# Altium schematic sheet LED_CONTROL.SchDoc: RGB_LED_STRIP_CONTROL_BOARD
size A4; Author: Luca Schenetti; DrawnBy: Luca Schenetti; Engineer: Luca Schenetti; Revision: V1.0; SheetNumber: 2; SheetTotal: 2
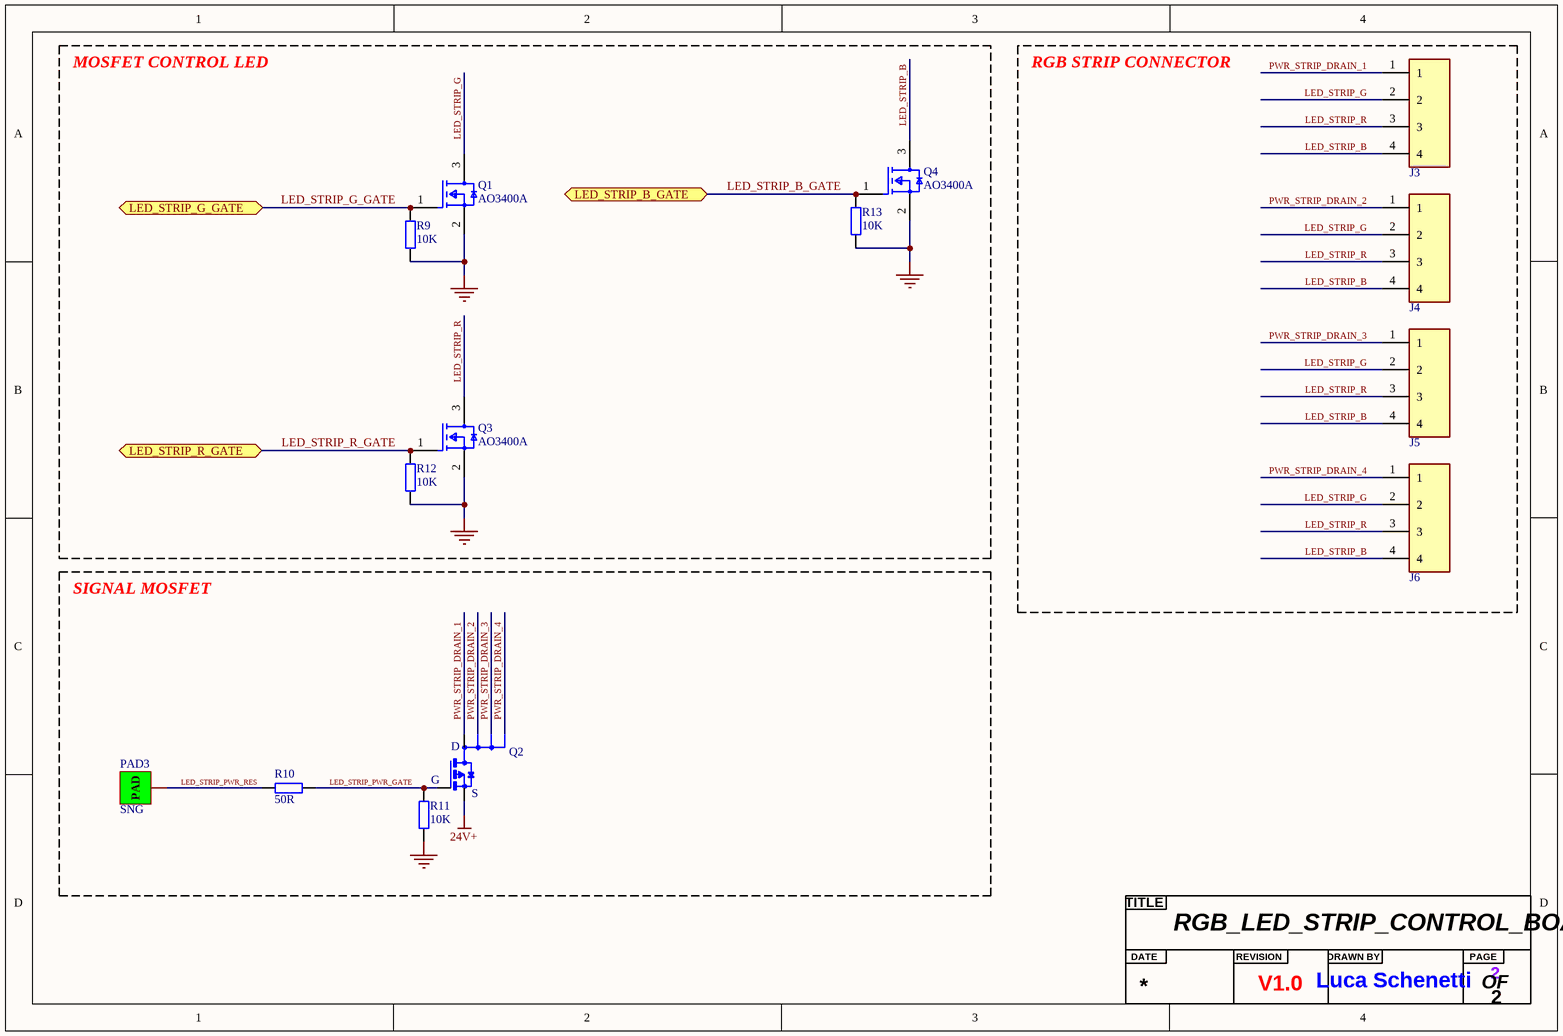
[diagram p0: LED_CONTROL.SchDoc]

## Parts
?  Title  (value not drawn)  (graphical)
J3  (no value)  [JST_PH_CONN]
J4  (no value)  [JST_PH_CONN]
J5  (no value)  [JST_PH_CONN]
J6  (no value)  [JST_PH_CONN]
PAD3  SNG  [PAD_SNG]
Q1  AO3400A  [FP-SOT23-MFG]
Q2  FDC610PZ  [FDC610PZ]  (value not drawn)
Q3  AO3400A  [FP-SOT23-MFG]
Q4  AO3400A  [FP-SOT23-MFG]
R9  10K  [RES_0402]
R10  50R  [RES_0603]
R11  10K  [RES_0402]
R12  10K  [RES_0402]
R13  10K  [RES_0402]

## Blocks framed on the sheet
MOSFET CONTROL LED: Q1 Q3 Q4 R9 R12 R13
RGB STRIP CONNECTOR: J3-J6
SIGNAL MOSFET: PAD3 Q2 R10 R11

## Ports
LED_STRIP_B_GATE (bidir, see MCU_STM32[2C]), LED_STRIP_G_GATE (bidir, see MCU_STM32[2C]), LED_STRIP_R_GATE (bidir, see MCU_STM32[2C])

## Nets
24V+: Q2.4(S)
GND: Q1.2(S) Q3.2(S) Q4.2(S) R9.1 R11.1 R12.1 R13.1
LED_STRIP_B: J3.4 J4.4 J5.4 J6.4 Q4.3(D)
LED_STRIP_B_GATE: Q4.1(G) R13.2 ; port LED_STRIP_B_GATE
LED_STRIP_G: J3.2 J4.2 J5.2 J6.2 Q1.3(D)
LED_STRIP_G_GATE: Q1.1(G) R9.2 ; port LED_STRIP_G_GATE
LED_STRIP_PWR_GATE: Q2.3(G) R10.2 R11.2
LED_STRIP_PWR_RES: PAD3.1(PAD) R10.1
LED_STRIP_R: J3.3 J4.3 J5.3 J6.3 Q3.3(D)
LED_STRIP_R_GATE: Q3.1(G) R12.2 ; port LED_STRIP_R_GATE
PWR_STRIP_DRAIN_1: J3.1 Q2.1(D1)
PWR_STRIP_DRAIN_2: J4.1 Q2.2(D2)
PWR_STRIP_DRAIN_3: J5.1 Q2.6(D3)
PWR_STRIP_DRAIN_4: J6.1 Q2.5(D4)

## Notes on the sheet
- (in symbol FDC610PZ) D
- (in symbol Title) TITLE; DATE; REVISION; DRAWN BY; PAGE; OF

## Library data of the parts
J3-J6 = JST_PH_CONN
PAD3 = PAD_SNG
Q1 Q3 Q4 = CMP-83955-000006-1: MOSFET N-CH 30V 5.7A SOT23 / [C20917]; Input Capacitance: 630pF; Number of Elements: 1; Rds On Max: 26.5mR; Max Power Dissipation: 1.4W; Gate to Source Voltage (Vgs): 12V; Min Operating Temperature: -55°C; Lead Free: Lead Free; Number of Pins: 3; Drain to Source Voltage (Vdss): 30V; Case/Package: SOT-23; Mount: Surface Mount; Continuous Drain Current (ID): 5.7A; Radiation Hardening: No; Packaging: Tape and Reel; Max Operating Temperature: 150°C; Power Dissipation: 1.4W
R9 R11-R13 = RES_0402: Resistor SMD 0402 [C25744]; Manufacturer: *; Manufacturer Part Number: *; Distributor Link: *; LCSC: *
R10 = RES_0603: Resistor SMD 0603[C849792]; Manufacturer: *; Manufacturer Part Number: *; Distributor Link: *; LCSC: *